# Altium project int_lock.PrjPcb
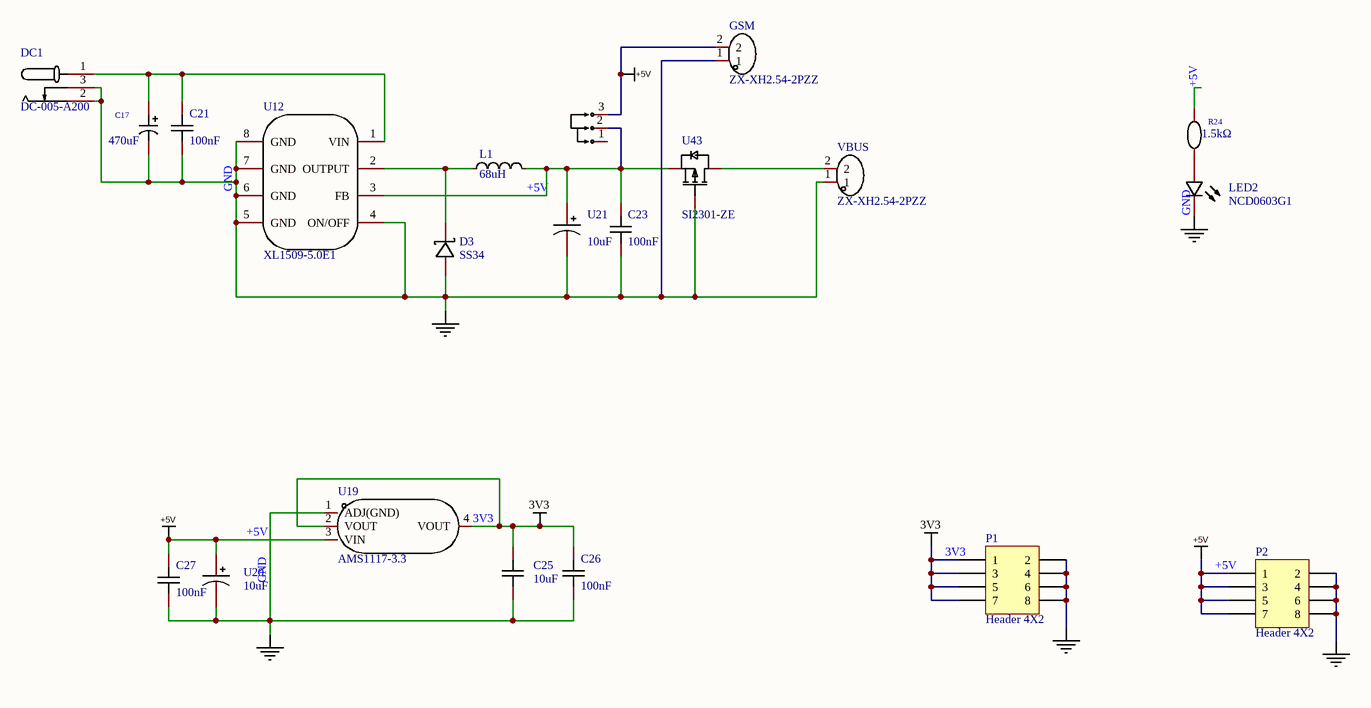
[diagram p0: 4_POW.schdoc.schdoc]
3 sheets, 60 parts. Net scope: global (net labels, ports and power ports of the same name join across sheets).
Board file: PCB1.pcbdoc
Sheets:
  4_POW.schdoc.schdoc
  3_语音模块.schdoc.schdoc
  2_MCU.schdoc.schdoc

## Sheet 4_POW.schdoc.schdoc
size 309 x 223 mm; Symbol: Sheet-Symbol_A4; Device: Sheet-Symbol_A4; @Page Name: POW.Schematic1; @Create Date: 2023-10-28; @Page Count: 4; @Page No: 3; @Project Name: New Project_2023-10-25_23-03-02; @Schematic Name: Schematic1; @Update Date: 2023-11-27; Company: 嘉立创EDA; Page Size: A4; Version: V1.0; SheetNumber: 1; SheetTotal: 4

### Parts
(Parts that share a designator on the sheet are numbered #1, #2 ... from top to bottom, then left to right.)
C17  470uF  [CAP-SMD_BD6.3-L6.6-W6.6-LS7.6-RD]
C21  100nF  [C0603]
C23  100nF  [C0603]
C25  10uF  [C0603]
C26  100nF  [C0603]
C27  100nF  [C0603]
D3  SS34  [SMA_L4.3-W2.6-LS5.0-RD]
DC1  DC-005-A200  [DC-IN-TH_DC-005-A200]
GSM  ZX-XH2.54-2PZZ  [CONN-TH_2P-P2.50_HX25003-2A]
L1  68uH  [IND-SMD_L6.0-W6.0_SWPA6045S]
LED2  NCD0603G1  [LED0603-RD]
P1  Header 4X2  [HDR2X4]
P2  Header 4X2  [HDR2X4]
R24  1.5kΩ  [R0603]
SW??  SS12D10G4 071  [3PINSW]  (value not drawn)
U12#1  XL1509-5.0E1  [SOIC-8_L5.0-W4.0-P1.27-LS6.0-BL]
U19  AMS1117-3.3  [SOT-223-3_L6.5-W3.4-P2.30-LS7.0-BR]
U20  10uF  [CAP-TH_BD6.3-P2.50-D0.5-FD]
U21  10uF  [CAP-TH_BD6.3-P2.50-D0.5-FD]
U43  SI2301-ZE  [SOT-23-3_L2.9-W1.3-P1.90-LS2.4-BR]
VBUS  ZX-XH2.54-2PZZ  [CONN-TH_2P-P2.50_HX25003-2A]

### Nets
3V3: C25.2 C26.2 P1.1 P1.3 P1.5 P1.7 U19.2(VOUT) U19.4(VOUT)
+5V: C23.2 C27.2 GSM.2 L1.2 P2.1 P2.3 P2.5 P2.7 R24.2 SW??.2 SW??.3 U12#1.3(FB) U19.3(VIN) U20.1 U21.1 U43.2(S)
GND: C17.2 C21.1 C23.1 C25.1 C26.1 C27.1 D3.2(A) DC1.2 DC1.3 GSM.1 LED2.1(K) P1.2 P1.4 P1.6 P1.8 P2.2 P2.4 P2.6 P2.8 U12#1.4(ON/OFF) U12#1.5(GND) U12#1.6(GND) U12#1.7(GND) U12#1.8(GND) U19.1(ADJ(GND)) U20.2 U21.2 U43.1(G) VBUS.1
NetC17_1: C17.1 C21.2 DC1.1 U12#1.1(VIN)
NetD3_1: D3.1(K) L1.1 U12#1.2(OUTPUT)
NetLED2_2: LED2.2(A) R24.1
NetU43_3: U43.3(D) VBUS.2

Not connected (* = marked no-connect by the designer): SW?? 1

### Notes on the sheet
- 1
- 2
- 3
- 4
- 5
- 6
- A
- B
- C
- 原理图
- Schematic1
- 创建日期
- 更新日期
- 2023-10-28
- 2023-11-27
- 审阅
- 绘制
- 图页
- POW.Schematic1
- 物料编码
- New Project_2023-10-25_23-03-02
- D
- 版本
- 尺寸
- 页
- 共
- V1.0
- A4
- 嘉立创EDA

### Library data of the parts
C17 = RVT1C471M0607: 容值:470uF;精度:±20%;额定电压:16V;电容体直径:6.3mm;电容体长度:7.7mm;工作寿命:2000hrs@105℃;工作温度:-55℃~+105℃;; Manufacturer: ROQANG(容强); Add into BOM: yes; Tolerance: ±20%; Rated Voltage: 16V; φD: 6.3mm; L: 7.7mm; Name: 470uF; Symbol: RVT1C471M0607; Device: RVT1C471M0607; LCSC Part Name: 470uF ±20% 16V; Supplier Part: C2977552; Manufacturer Part: RVT1C471M0607; Supplier Footprint: SMD,6.3x7.7mm; JLCPCB Part Class: 扩展库; Supplier: LCSC; Convert to PCB: yes; Value: 470uF; Lifetime @ Temp: 2000hrs@105℃; Operating Temperature: -55℃~+105℃
C21 C23 C26 C27 = CGA3E3X8R1H104M080AE: 容值:100nF;精度:±20%;额定电压:50V;材质(温度系数):X8R;; Manufacturer: TDK; Add into BOM: yes; Tolerance: ±20%; Voltage Rated: 50V; Temperature Coefficient: X8R; Name: 100nF; Symbol: CGA3E3X8R1H104M080AE; Device: CGA3E3X8R1H104M080AE; LCSC Part Name: 100nF ±20% 50V; Supplier Part: C3855738; Manufacturer Part: CGA3E3X8R1H104M080AE; Supplier Footprint: 0603; Supplier: LCSC; Convert to PCB: yes; Value: 100nF
C25 = C1608X6S0J106M080AC: 容值:10uF;精度:±20%;额定电压:6.3V;材质(温度系数):X6S;; Manufacturer: TDK; Symbol: C1608X6S0J106M080AC_C314596-1; Add into BOM: yes; Tolerance: ±20%; Voltage Rated: 6.3V; Temperature Coefficient: X6S; Name: 10uF; Device: C1608X6S0J106M080AC; LCSC Part Name: 10uF ±20% 6.3V; Supplier Part: C314596; Manufacturer Part: C1608X6S0J106M080AC; Supplier Footprint: 0603; Datasheet: https://atta.szlcsc.com/upload/public/pdf/source/20221212/519F8C46C56E78A46759B3245CB4AD37.pdf; Supplier: LCSC; Convert to PCB: yes; Value: 10uF
D3 = SS34: Symbol: SS34_C9900023345; Add into BOM: yes; Name: SS34; Device: SS34; LCSC Part Name: SS34; Supplier Part: C9900023345; Manufacturer Part: SS34; Supplier Footprint: SMA,DO-214AC; JLCPCB Part Class: 扩展库; Datasheet: 2022-07-04/534833A/5ff3008f79ea4c6ab22b1f3463cee262/20210714020425519.pdf; Supplier: LCSC; Convert to PCB: yes
DC1 = DC-005-A200: DC-005 外径6.4 内芯2.0 3A电流 DC电源插座; Manufacturer: XUNPU(讯普); Add into BOM: yes; Name: DC-005-A200; Symbol: DC-005-A200; Device: DC-005-A200; LCSC Part Name: DC-005-A200; Supplier Part: C720557; Manufacturer Part: DC-005-A200; Supplier Footprint: 14×9.0×11.0mm; JLCPCB Part Class: 扩展库; Datasheet: https://atta.szlcsc.com/upload/public/pdf/source/20200812/C720557_2286DFCD6C75B71AF905731F627ABF3A.pdf; Supplier: LCSC; Convert to PCB: yes
GSM VBUS = ZX-XH2.54-2PZZ: 参考系列:XH;间距:2.54mm;插针结构:1x2P;排数:1;每排PIN数:2;行距:-;公母:公型插针;安装方式:直插;额定电流:3A;触头材质:黄铜;触头镀层:锡;工作温度范围:-25℃~+85℃;焊接温度(最大值):260℃;; Manufacturer: Megastar(兆星); Add into BOM: yes; Reference Series: XH; Pitch: 2.54mm; Pins Structure: 1x2P; Number of PINs Per Row: 2; Gender: 公型插针; Current Rating (Max): 3A; Welding Temperature (Max): 260℃; Name: ZX-XH2.54-2PZZ; Symbol: ZX-XH2.54-2PZZ; Device: ZX-XH2.54-2PZZ; LCSC Part Name: 系列:XH 间距:2.54mm 1x2P 直插; Supplier Part: C7429632; Manufacturer Part: ZX-XH2.54-2PZZ; Supplier Footprint: 插件,P=2.54mm; JLCPCB Part Class: 扩展库; Datasheet: https://atta.szlcsc.com/upload/public/pdf/source/20230619/19BA6947230AA44A04D3EDD65E618FD0.pdf; Supplier: LCSC; Convert to PCB: yes; Number of Rows: 1; Row Spacing: -; Mounting Style: 直插; Contact Material: 黄铜; Contact Plating: 锡; Operating Temperature Range: -25℃~+85℃
L1 = SWPA6045S680MT: 类型:-;电感值:68uH;精度:±20%;额定电流:1A;饱和电流(Isat):1.2A;; Manufacturer: Sunlord(顺络); Add into BOM: yes; Tolerance: ±20%; Rated Current: 1A; Saturation Current (Isat): 1.2A; DC Resistance (DCR): 289mΩ; Name: 68uH; Symbol: SWPA6045S680MT; Device: SWPA6045S680MT; LCSC Part Name: 68uH ±20% 1.2A; Supplier Part: C53663; Manufacturer Part: SWPA6045S680MT; Supplier Footprint: SMD; JLCPCB Part Class: 扩展库; Datasheet: https://atta.szlcsc.com/upload/public/pdf/source/20210916/AC798BA7E846B7D0B6818F45CD84DB0B.pdf; Supplier: LCSC; Convert to PCB: yes; Type: -; Value: 68uH; Ratings: -
LED2 = NCD0603G1: 发光颜色:翠绿色;功率:72mW;透镜颜色:无色透明;主波长:515nm~530nm;发光强度:330mcd~900mcd;发光角度:130°;工作温度:-30℃~+85℃;; Manufacturer: 国星光电; Symbol: FC-D1608UGK-520D10; Add into BOM: yes; Emitted Color: 翠绿色; Forward Voltage (VF): 2.6V~3.6V; Forward Current: 10mA; Power Dissipation: 72mW; Lens Color: 无色透明; Viewing Angle: 130°; Name: NCD0603G1; Device: NCD0603G1; LCSC Part Name: 翠绿 0603翠绿  正贴; Supplier Part: C84267; Manufacturer Part: NCD0603G1; Supplier Footprint: 0603; JLCPCB Part Class: 扩展库; Datasheet: https://atta.szlcsc.com/upload/public/pdf/source/20200820/C84267_04BA7703640BAC111D09F5EFB971FBF3.pdf; Supplier: LCSC; Convert to PCB: yes; Dominant Wavelength: 515nm~530nm; Luminous Intensity: 330mcd~900mcd; Operating Temperature: -30℃~+85℃
P1 P2 = Header 4X2: Header, 4-Pin, Dual row; LatestRevisionDate: 17-Jul-2002; LatestRevisionNote: Re-released for DXP Platform.; Publisher: Altium Limited
R24 = SCR0603F1K: 阻值:1.5kΩ;精度:±1%;; Manufacturer: VO(翔胜); Name: Value; Add into BOM: yes; Value: 1kΩ; Tolerance: ±1%; Symbol: SCR0603F1K; Device: SCR0603F1K; LCSC Part Name: 1kΩ ±1%; Supplier Part: C3016283; Manufacturer Part: SCR0603F1K; Supplier Footprint: 0603; JLCPCB Part Class: 扩展库; Datasheet: https://atta.szlcsc.com/upload/public/pdf/source/20220513/247AF9639BA21CF93567DC289CCC6A22.pdf; Supplier: LCSC; Convert to PCB: yes
SW?? = SS12D10G4 071: Manufacturer: SHOU HAN(首韩); Add into BOM: yes; Circuit: 单刀双掷; Pin Style: PC引脚; Switch Length: 12.7mm; Switch Width: 6.7mm; Switch Height: 6.4mm; Current Rating (DC): 2A; Voltage Rating (DC): 125V; Mechanical Life: 3千次; Symbol: SS12D10G4 071; Device: SS12D10G4 071; Supplier: LCSC; Supplier Part: C2887259; Manufacturer Part: SS12D10G4 071; JLCPCB Part Class: Extended Part; LCSC Part Name: SS12D10G4 071; Supplier Footprint: 插件; Datasheet: https://atta.szlcsc.com/upload/public/pdf/source/20210820/80D1704BBF3FCEE0435FCAA54C61E0A3.pdf; Convert to PCB: yes; Actuator Style: -; Mounting Style: 立插; Actuator Color: -; Current Rating (AC): -; Voltage Rating (AC): -; Operating Temperature: -16℃~+60℃
U12#1 = XL1509-5.0E1: 功能类型:降压型;输入电压:-;输出电流(最大值):-;; Manufacturer: XLSEMI(芯龙); Add into BOM: yes; Function: 降压型; Name: XL1509-5.0E1; Symbol: XL1509-5.0E1; Device: XL1509-5.0E1; LCSC Part Name: XL1509-5.0E1; Supplier Part: C61063; Manufacturer Part: XL1509-5.0E1; Supplier Footprint: SOP-8; JLCPCB Part Class: 基础库; Datasheet: https://atta.szlcsc.com/upload/public/pdf/source/20151126/1457707596805.pdf; Supplier: LCSC; Convert to PCB: yes; Synchronous Rectification: -; Number of Outputs: -; Topology: -; Input Voltage: -; Output Current (Max): -; Switching Frequency: -
U19 = AMS1117-3.3: 输出类型:固定;输出极性:正;输出通道数:1;最大输入电压:18V;输出电压:3.3V;压差:1.3V@(1A);输出电流:1A;电源纹波抑制比(PSRR):60dB@(120Hz);工作温度:±150℃@(Tj);; Manufacturer: YONGYUTAI(永裕泰); Symbol: AMS1117-3.3_C2891839; Add into BOM: yes; Output Type: 固定; Output Polarity: 正; Number of Outputs: 1; Maximum Input Voltage: 18V; Output Voltage: 3.3V; Name: AMS1117-3.3; Device: AMS1117-3.3; LCSC Part Name: 正 Vin=18V Vout=3.3V 1A 60dB@(120Hz); Supplier Part: C2891839; Manufacturer Part: AMS1117-3.3; Supplier Footprint: SOT-223-3; JLCPCB Part Class: 扩展库; Datasheet: https://atta.szlcsc.com/upload/public/pdf/source/20210901/A75ADDE6A17DEE0002F2A58A8D1F3634.pdf; Supplier: LCSC; Convert to PCB: yes; Dropout Voltage: 1.3V@(1A); Output Current: 1A; Power Supply Rejection Ratio (PSRR): 60dB@(120Hz); Operating Temperature: ±150℃@(Tj)
U20 U21 = ESK106M1HD11RRSNP-R: 容值:10uF;精度:±20%;额定电压:50V;纹波电流:-;等效串联电阻:-;; Manufacturer: MAN YUE(万裕科技); Add into BOM: yes; Tolerance: ±20%; Rated Voltage: 50V; φD: 5mm; L: 11mm; Name: 10uF; Symbol: ESK106M1HD11RRSNP-R; Device: ESK106M1HD11RRSNP-R; LCSC Part Name: 10uF ±20% 50V; Supplier Part: C3015490; Manufacturer Part: ESK106M1HD11RRSNP-R; Supplier Footprint: 插件; JLCPCB Part Class: 扩展库; Datasheet: https://atta.szlcsc.com/upload/public/pdf/source/20190724/C406799_CDF11B2185D3B9C175922EABD678815E.pdf; Supplier: LCSC; Convert to PCB: yes; Value: 10uF; Lead Spacing: -; Ripple Current: -; Equivalent Series Resistance(ESR): -; Lifetime @ Temp: -; Operating Temperature: -
U43 = SI2301-ZE: 漏源电压(Vdss):20V;连续漏极电流(Id):2.3A;功率(Pd):700mW;类型:P沟道;导通电阻(RDS(on)@Vgs,Id):126mΩ@4.5V;; Manufacturer: HXY MOSFET(华轩阳电子); Add into BOM: yes; Gate Threshold Voltage (Vgs(th)@Id): 1V@250uA; Drain Source Voltage (Vdss): 20V; Continuous Drain Current (Id): 2.3A; Power Dissipation (Pd): 700mW; Input Capacitance (Ciss@Vds): 285pF; Name: SI2301-ZE; Symbol: SI2301-ZE; Device: SI2301-ZE; LCSC Part Name: P沟道 耐压:20V 电流:2.3A; Supplier Part: C5261052; Manufacturer Part: SI2301-ZE; Supplier Footprint: SOT-23; JLCPCB Part Class: 扩展库; Datasheet: https://atta.szlcsc.com/upload/public/pdf/source/20230515/2FF2907841563ED329594D3237822724.pdf; Supplier: LCSC; Convert to PCB: yes; Type: P沟道; Drain Source On Resistance (RDS(on)@Vgs,Id): 126mΩ@4.5V

## Sheet 3_语音模块.schdoc.schdoc
size 309 x 223 mm; Symbol: Sheet-Symbol_A4; Device: Sheet-Symbol_A4; @Page Name: 语音模块; @Create Date: 2023-10-28; @Page Count: 4; @Page No: 2; @Project Name: New Project_2023-10-25_23-03-02; @Schematic Name: Schematic1; @Update Date: 2023-11-07; Company: 嘉立创EDA; Page Size: A4; Version: V1.0; SheetNumber: 2; SheetTotal: 4
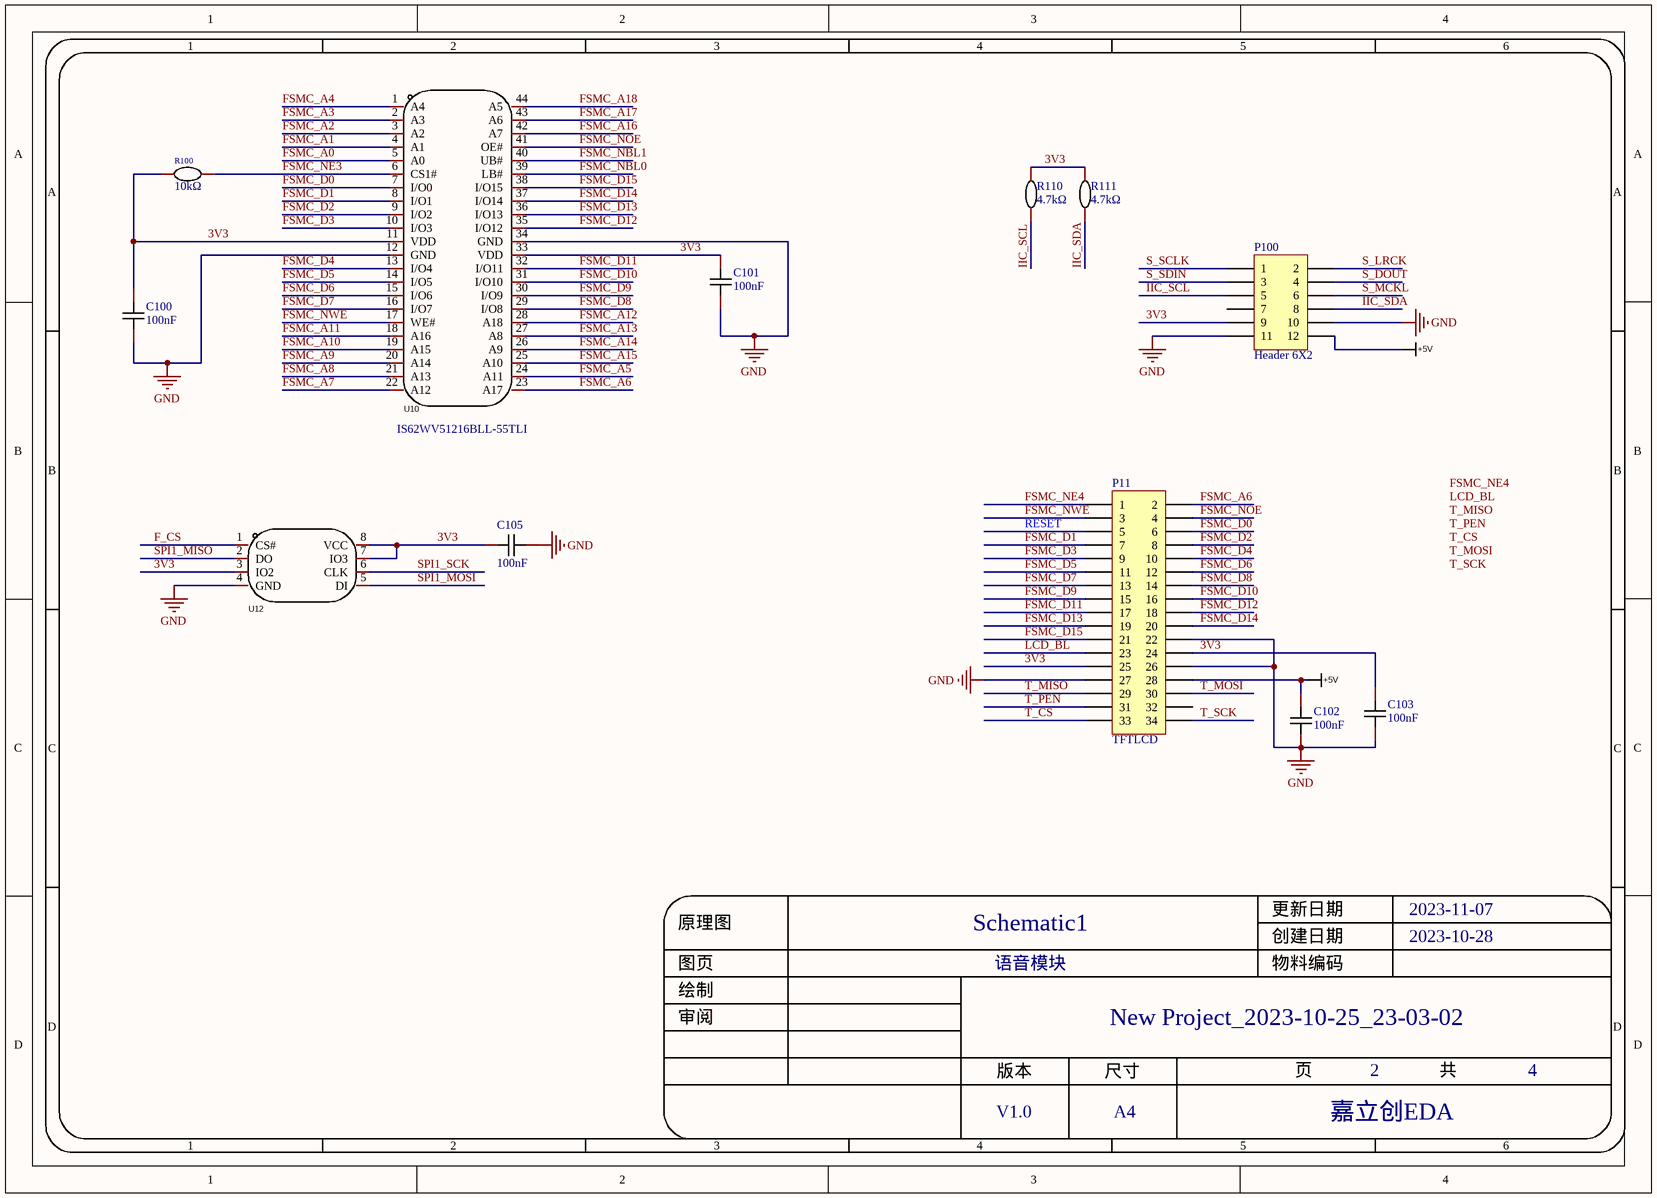
[diagram p1: 3_语音模块.schdoc.schdoc]

### Parts
(Parts that share a designator on the sheet are numbered #1, #2 ... from top to bottom, then left to right.)
C100  100nF  [C0603]
C101  100nF  [C0603]
C102  100nF  [C0603]
C103  100nF  [C0603]
C105  100nF  [C0603]
P11  TFTLCD  [HDR2X17]
P100  Header 6X2  [HDR2X6]
R100  10kΩ  [R0603]
R110  4.7kΩ  [R0603]
R111  4.7kΩ  [R0603]
U10  IS62WV51216BLL-55TLI  [SRAM]
U12#2  W25Q128JVSIQ  [eeprom]  (value not drawn)

### Nets
3V3: C100.2 C101.2 C103.2 C105.2 P11.24 P11.25 P100.9 R100.1 R110.2 R111.2 U10.11(VDD) U10.33(VDD) U12#2.3(IO2) U12#2.7(IO3) U12#2.8(VCC)
+5V: C102.2 P11.28 P100.12
GND: C100.1 C101.1 C102.1 C103.1 C105.1 P11.22 P11.26 P11.27 P100.10 P100.11 U10.12(GND) U10.34(GND) U12#2.4(GND)
F_CS: U12#2.1(CS#)
FSMC_A0: U10.5(A0)
FSMC_A1: U10.4(A1)
FSMC_A2: U10.3(A2)
FSMC_A3: U10.2(A3)
FSMC_A4: U10.1(A4)
FSMC_A5: U10.24(A11)
FSMC_A6: P11.2 U10.23(A17)
FSMC_A7: U10.22(A12)
FSMC_A8: U10.21(A13)
FSMC_A9: U10.20(A14)
FSMC_A10: U10.19(A15)
FSMC_A11: U10.18(A16)
FSMC_A12: U10.28(A18)
FSMC_A13: U10.27(A8)
FSMC_A14: U10.26(A9)
FSMC_A15: U10.25(A10)
FSMC_A16: U10.42(A7)
FSMC_A17: U10.43(A6)
FSMC_A18: U10.44(A5)
FSMC_D0: P11.6 U10.7(I/O0)
FSMC_D1: P11.7 U10.8(I/O1)
FSMC_D2: P11.8 U10.9(I/O2)
FSMC_D3: P11.9 U10.10(I/O3)
FSMC_D4: P11.10 U10.13(I/O4)
FSMC_D5: P11.11 U10.14(I/O5)
FSMC_D6: P11.12 U10.15(I/O6)
FSMC_D7: P11.13 U10.16(I/O7)
FSMC_D8: P11.14 U10.29(I/O8)
FSMC_D9: P11.15 U10.30(I/O9)
FSMC_D10: P11.16 U10.31(I/O10)
FSMC_D11: P11.17 U10.32(I/O11)
FSMC_D12: P11.18 U10.35(I/O12)
FSMC_D13: P11.19 U10.36(I/O13)
FSMC_D14: P11.20 U10.37(I/O14)
FSMC_D15: P11.21 U10.38(I/O15)
FSMC_NBL0: U10.39(LB#)
FSMC_NBL1: U10.40(UB#)
FSMC_NE3: R100.2 U10.6(CS1#)
FSMC_NE4: P11.1
FSMC_NOE: P11.4 U10.41(OE#)
FSMC_NWE: P11.3 U10.17(WE#)
IIC_SCL: P100.5 R110.1
IIC_SDA: P100.8 R111.1
LCD_BL: P11.23
RESET: P11.5
S_DOUT: P100.4
S_LRCK: P100.2
S_MCKL: P100.6  [project net DCMI_D0]
S_SCLK: P100.1
S_SDIN: P100.3
SPI1_MISO: U12#2.2(DO)
SPI1_MOSI: U12#2.5(DI)
SPI1_SCK: U12#2.6(CLK)
T_CS: P11.33
T_MISO: P11.29
T_MOSI: P11.30
T_PEN: P11.31
T_SCK: P11.34

Not connected (* = marked no-connect by the designer): P11 32; P100 7

### Notes on the sheet
- Labels drawn without touching a wire or pin: FSMC_NE4, LCD_BL, T_CS, T_MISO, T_MOSI, T_PEN, T_SCK
- 1
- 2
- 3
- 4
- 5
- 6
- A
- B
- C
- 原理图
- Schematic1
- 创建日期
- 更新日期
- 2023-10-28
- 2023-11-07
- 审阅
- 绘制
- 图页
- 语音模块
- 物料编码
- New Project_2023-10-25_23-03-02
- D
- 版本
- 尺寸
- 页
- 共
- V1.0
- A4
- 嘉立创EDA

### Library data of the parts
C100-C103 C105 = CGA3E3X8R1H104M080AE: as C21 on sheet 4_POW.schdoc; Symbol: CGA3E3X8R1H104M080AE; Device: CGA3E3X8R1H104M080AE; LCSC Part Name: 100nF ±20% 50V; Supplier Part: C3855738; Manufacturer Part: CGA3E3X8R1H104M080AE; Supplier Footprint: 0603; Supplier: LCSC; Convert to PCB: yes; Value: 100nF; Name: 100nF
P11 = Header 17X2: Header, 17-Pin, Dual row; LatestRevisionDate: 17-Jul-2002; LatestRevisionNote: Re-released for DXP Platform.; Publisher: Altium Limited
P100 = Header 6X2: Header, 6-Pin, Dual row; LatestRevisionDate: 17-Jul-2002; LatestRevisionNote: Re-released for DXP Platform.; Publisher: Altium Limited
R100 = SCR0603J10K: 阻值:10kΩ;精度:±5%;; Manufacturer: VO(翔胜); Add into BOM: yes; Tolerance: ±5%; Name: 10kΩ; Symbol: SCR0603J10K; Device: SCR0603J10K; LCSC Part Name: 10kΩ ±5%; Supplier Part: C3017715; Manufacturer Part: SCR0603J10K; Supplier Footprint: 0603; JLCPCB Part Class: 扩展库; Datasheet: https://atta.szlcsc.com/upload/public/pdf/source/20220513/247AF9639BA21CF93567DC289CCC6A22.pdf; Supplier: LCSC; Convert to PCB: yes; Value: 10kΩ
R110 R111 = AR03FTDX4701A: 电阻类型:薄膜电阻;阻值:4.7kΩ;精度:±1%;功率:100mW;; Manufacturer: Viking(光颉); Add into BOM: yes; Tolerance: ±1%; Power(Watts): 100mW; Temperature Coefficient: ±50ppm/℃; Overload Voltage (Max): 75V; Name: 4.7kΩ; Symbol: AR03FTDX4701A; Device: AR03FTDX4701A; LCSC Part Name: 4.7kΩ ±1% 100mW; Supplier Part: C2924150; Manufacturer Part: AR03FTDX4701A; Supplier Footprint: 0603; JLCPCB Part Class: 扩展库; Datasheet: https://atta.szlcsc.com/upload/public/pdf/source/20211123/7AFDB03DAF68AA91648A852AAE26A3AB.pdf; Supplier: LCSC; Convert to PCB: yes; Type: 薄膜电阻; Value: 4.7kΩ; Operating Temperature Range: -55℃~+155℃
U10 = IS62WV51216BLL-55TLI: Manufacturer: ISSI(美国芯成); Add into BOM: yes; Symbol: IS62WV51216BLL-55TLI; Device: IS62WV51216BLL-55TLI; Supplier: LCSC; Manufacturer Part: IS62WV51216BLL-55TLI; Supplier Part: C11315; JLCPCB Part Class: Extended Part; LCSC Part Name: IS62WV51216BLL-55TLI; Supplier Footprint: TSOPII-44; Datasheet: https://atta.szlcsc.com/upload/public/pdf/source/20130225/1457706593006.pdf; Convert to PCB: yes
U12#2 = W25Q128JVSIQ: Manufacturer: WINBOND(华邦); Symbol: W25Q128JVSIQTR; Add into BOM: yes; Memory Size: 128Mbit; Device: W25Q128JVSIQ; Supplier: LCSC; Manufacturer Part: W25Q128JVSIQ; Supplier Part: C97521; JLCPCB Part Class: Basic Part; LCSC Part Name: W25Q128JVSIQ 编带; Supplier Footprint: SOP-8-208mil; Datasheet: https://atta.szlcsc.com/upload/public/pdf/source/20170316/1489627409956.pdf; Convert to PCB: yes; Interface Type: -; Clock Frequency (fc): -; Supply Voltage: -; Supply Current (Read): -; Supply Current (Program): -; Supply Current (Erase): -; Standby supply current: -; Page Programming Time (Tpp): -; Block Erase Time (tBE): -; Data Retention - TDR (Year): -; Operating Temperature: -

## Sheet 2_MCU.schdoc.schdoc
size 431 x 309 mm; Symbol: Sheet-Symbol_A4; Device: Sheet-Symbol_A4; @Page Name: MCU; @Create Date: 2023-11-05; @Page Count: 4; @Page No: 4; @Project Name: New Project_2023-10-25_23-03-02; @Schematic Name: Schematic1; @Update Date: 2023-12-01; Company: 嘉立创EDA; Page Size: A4; Version: V1.0; SheetNumber: 4; SheetTotal: 4
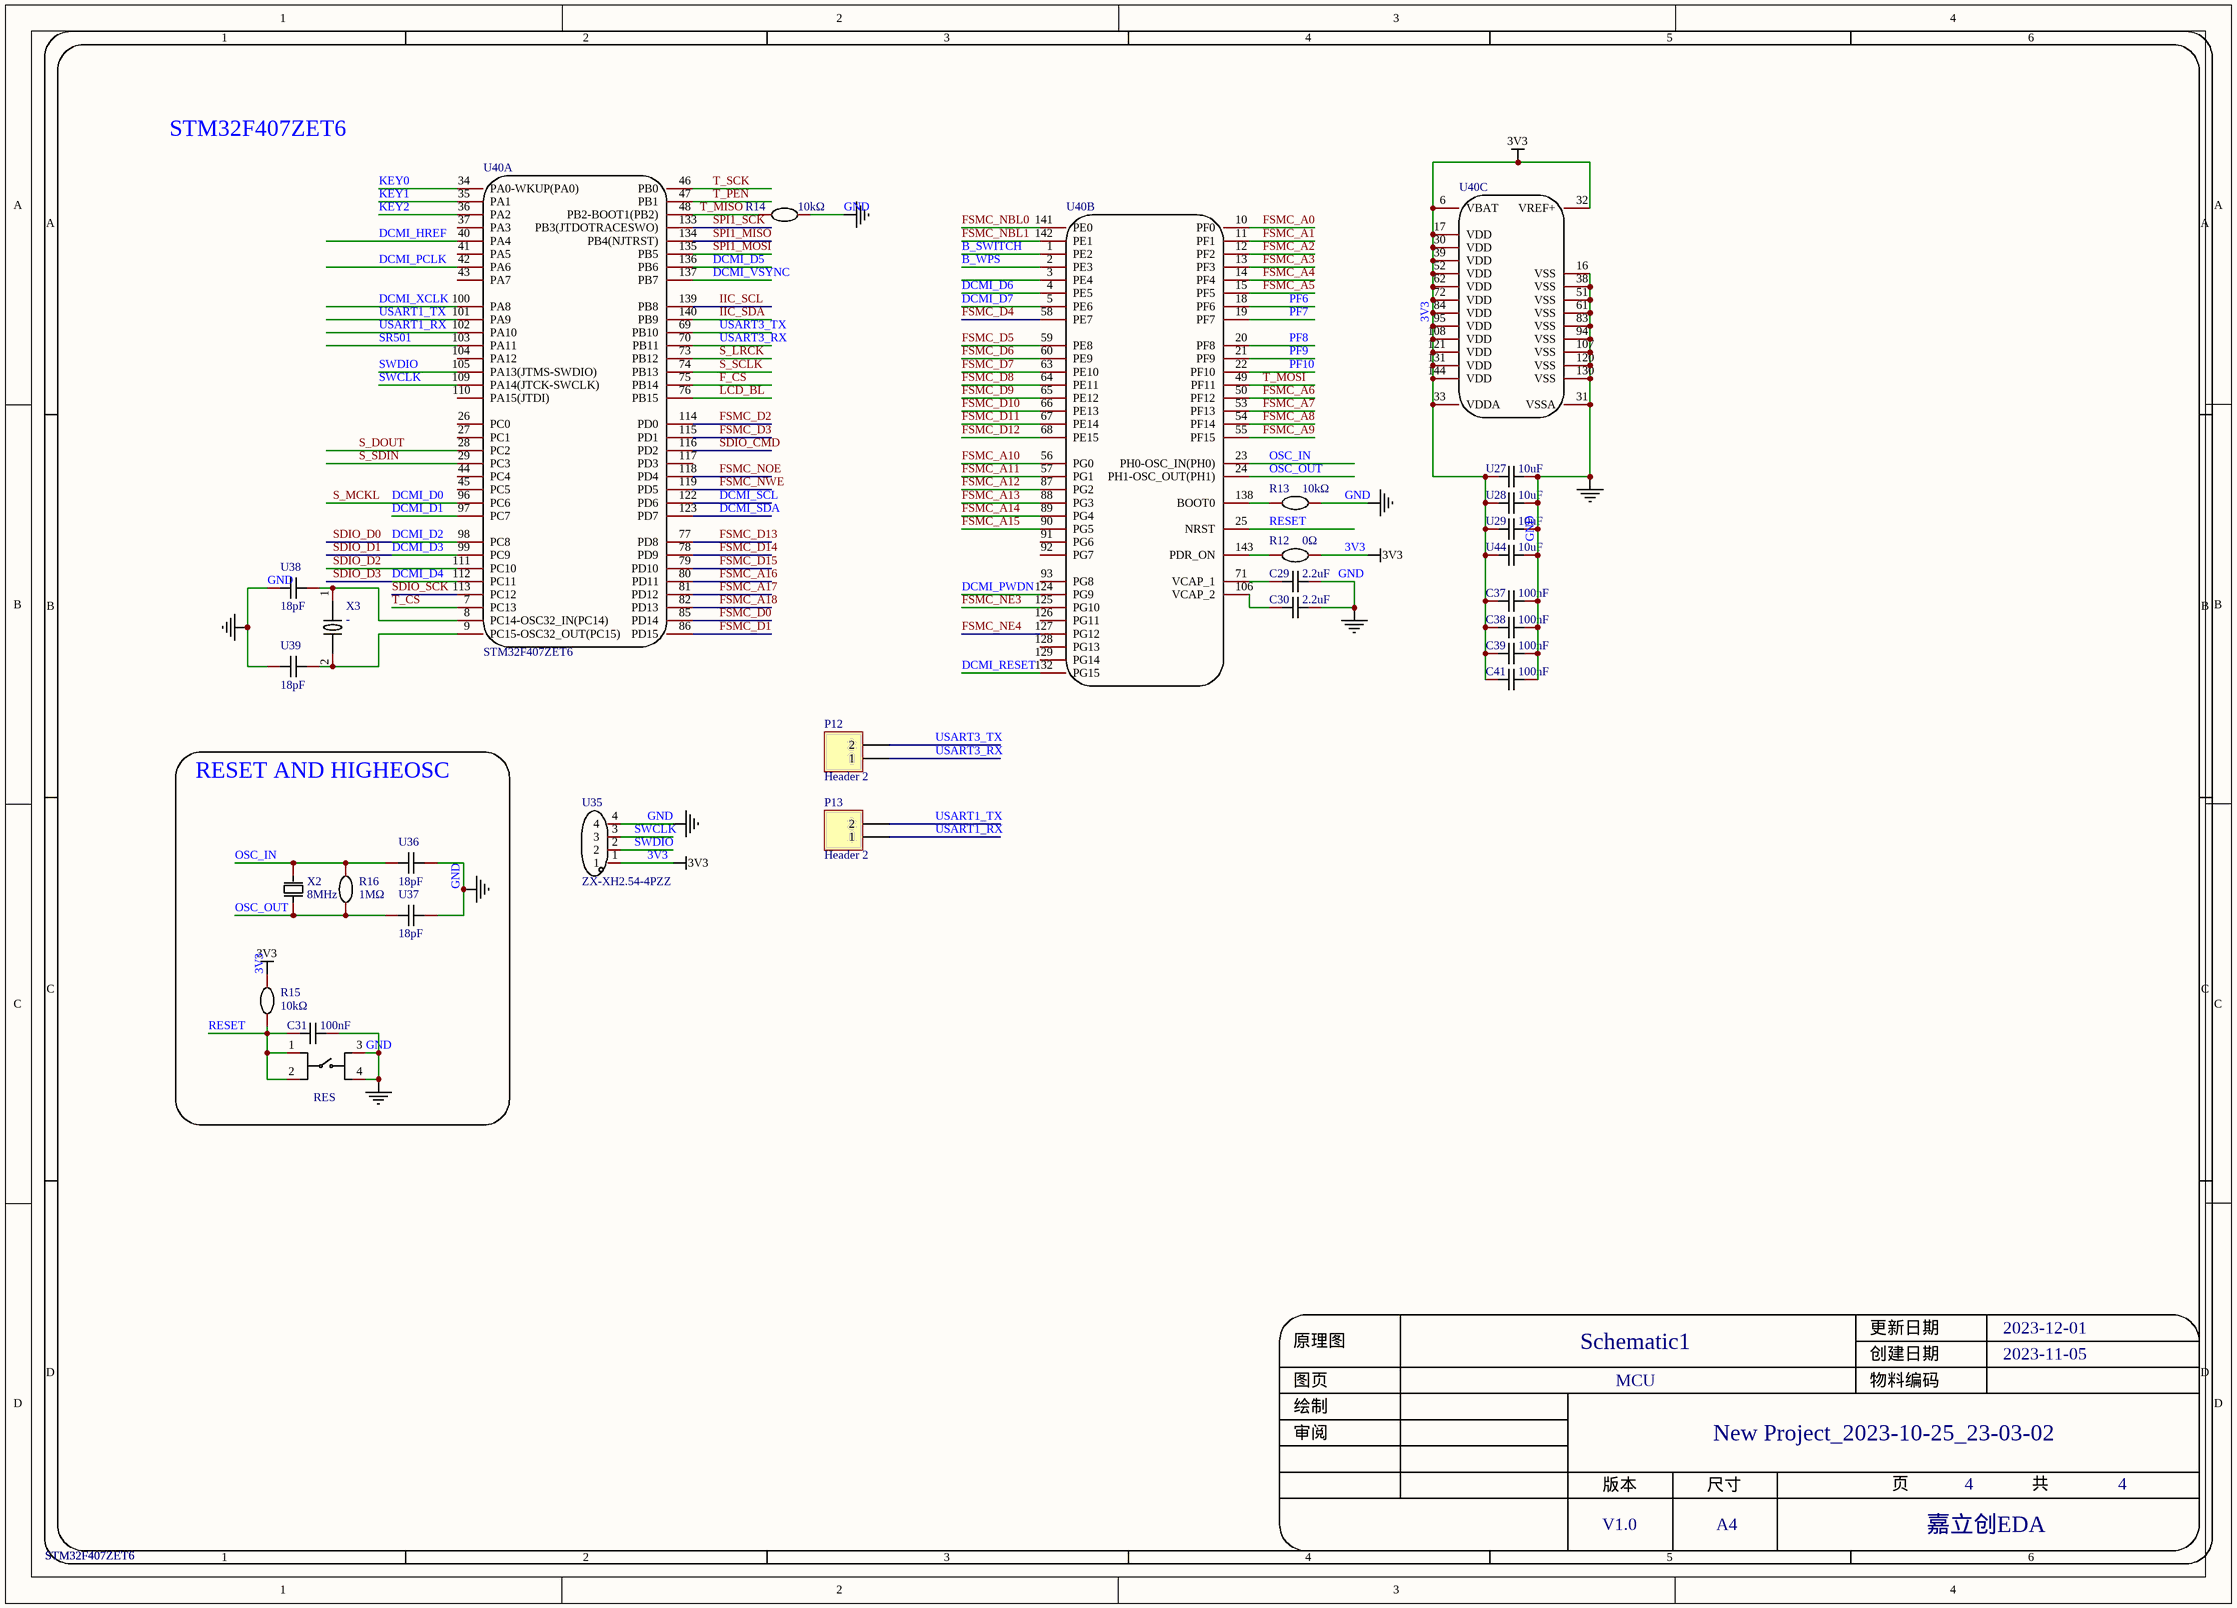
[diagram p2: 2_MCU.schdoc.schdoc]

### Parts
C29  2.2uF  [C0603]
C30  2.2uF  [C0603]
C31  100nF  [C0603]
C37  100nF  [C0603]
C38  100nF  [C0603]
C39  100nF  [C0603]
C41  100nF  [C0603]
P12  Header 2  [HDR1X2]
P13  Header 2  [HDR1X2]
R12  0Ω  [R0603]
R13  10kΩ  [R0603]
R14  10kΩ  [R0603]
R15  10kΩ  [R0603]
R16  1MΩ  [R0603]
RES  K2-6639SP-C4SC-04  [KEY-SMD_4P-L6.0-W6.0-P3.90-LS10.0]  (value not drawn)
U27  10uF  [C0603]
U28  10uF  [C0603]
U29  10uF  [C0603]
U35  ZX-XH2.54-4PZZ  [CONN-TH_4P-P2.50_4PIN]
U36  18pF  [C0603]
U37  18pF  [C0603]
U38  18pF  [C0603]
U39  18pF  [C0603]
U40  STM32F407ZET6  [LQFP-144_L20.0-W20.0-P0.50-LS22.0-BL]  (parts A,B,C of 3)
U44  10uF  [C0603]
X2  8MHz  [OSC-SMD_L5.0-W3.2]
X3  -  [OSC-SMD_2P-L1.6-W1.0]

### Blocks framed on the sheet
RESET AND HIGHEOSC: C31 R15 R16 RES U36 U37 X2

### Nets
3V3: C37.1 C38.1 C39.1 C41.1 R12.2 R15.2 U27.1 U28.1 U29.1 U35.1 U40.6(VBAT) U40.17(VDD) U40.30(VDD) U40.32(VREF+) U40.33(VDDA) U40.39(VDD) U40.52(VDD) U40.62(VDD) U40.72(VDD) U40.84(VDD) U40.95(VDD) U40.108(VDD) U40.121(VDD) U40.131(VDD) U40.144(VDD) U44.1
GND: C29.2 C30.2 C31.2 C37.2 C38.2 C39.2 C41.2 R13.2 R14.2 RES.3 RES.4 U27.2 U28.2 U29.2 U35.4 U36.2 U37.2 U38.1 U39.1 U40.16(VSS) U40.31(VSSA) U40.38(VSS) U40.51(VSS) U40.61(VSS) U40.83(VSS) U40.94(VSS) U40.107(VSS) U40.120(VSS) U40.130(VSS) U44.2
B_SWITCH: U40.1(PE2)
B_WPS: U40.2(PE3)
DCMI_D0: U40.96(PC6)  [also labelled S_MCKL]
DCMI_D1: U40.97(PC7)
DCMI_D2: U40.98(PC8)  [also labelled SDIO_D0]
DCMI_D3: U40.99(PC9)  [also labelled SDIO_D1]
DCMI_D4: U40.112(PC11)  [also labelled SDIO_D3]
DCMI_D5: U40.136(PB6)
DCMI_D6: U40.4(PE5)
DCMI_D7: U40.5(PE6)
DCMI_HREF: U40.40(PA4)
DCMI_PCLK: U40.42(PA6)
DCMI_PWDN: U40.124(PG9)
DCMI_RESET: U40.132(PG15)
DCMI_SCL: U40.122(PD6)
DCMI_SDA: U40.123(PD7)
DCMI_VSYNC: U40.137(PB7)
DCMI_XCLK: U40.100(PA8)
F_CS: U40.75(PB14)
FSMC_A0: U40.10(PF0)
FSMC_A1: U40.11(PF1)
FSMC_A2: U40.12(PF2)
FSMC_A3: U40.13(PF3)
FSMC_A4: U40.14(PF4)
FSMC_A5: U40.15(PF5)
FSMC_A6: U40.50(PF12)
FSMC_A7: U40.53(PF13)
FSMC_A8: U40.54(PF14)
FSMC_A9: U40.55(PF15)
FSMC_A10: U40.56(PG0)
FSMC_A11: U40.57(PG1)
FSMC_A12: U40.87(PG2)
FSMC_A13: U40.88(PG3)
FSMC_A14: U40.89(PG4)
FSMC_A15: U40.90(PG5)
FSMC_A16: U40.80(PD11)
FSMC_A17: U40.81(PD12)
FSMC_A18: U40.82(PD13)
FSMC_D0: U40.85(PD14)
FSMC_D1: U40.86(PD15)
FSMC_D2: U40.114(PD0)
FSMC_D3: U40.115(PD1)
FSMC_D4: U40.58(PE7)
FSMC_D5: U40.59(PE8)
FSMC_D6: U40.60(PE9)
FSMC_D7: U40.63(PE10)
FSMC_D8: U40.64(PE11)
FSMC_D9: U40.65(PE12)
FSMC_D10: U40.66(PE13)
FSMC_D11: U40.67(PE14)
FSMC_D12: U40.68(PE15)
FSMC_D13: U40.77(PD8)
FSMC_D14: U40.78(PD9)
FSMC_D15: U40.79(PD10)
FSMC_NBL0: U40.141(PE0)
FSMC_NBL1: U40.142(PE1)
FSMC_NE3: U40.125(PG10)
FSMC_NE4: U40.127(PG12)
FSMC_NOE: U40.118(PD4)
FSMC_NWE: U40.119(PD5)
IIC_SCL: U40.139(PB8)
IIC_SDA: U40.140(PB9)
KEY0: U40.34(PA0-WKUP(PA0))
KEY1: U40.35(PA1)
KEY2: U40.36(PA2)
LCD_BL: U40.76(PB15)
OSC_IN: R16.2 U36.1 U40.23(PH0-OSC_IN(PH0)) X2.2(OSC2)
OSC_OUT: R16.1 U37.1 U40.24(PH1-OSC_OUT(PH1)) X2.1(OSC1)
PF6: U40.18(PF6)
PF7: U40.19(PF7)
PF8: U40.20(PF8)
PF9: U40.21(PF9)
PF10: U40.22(PF10)
RESET: C31.1 R15.1 RES.1 RES.2 U40.25(NRST)
S_DOUT: U40.28(PC2)
S_LRCK: U40.73(PB12)
S_SCLK: U40.74(PB13)
S_SDIN: U40.29(PC3)
SDIO_CMD: U40.116(PD2)
SDIO_D2: U40.111(PC10)
SDIO_SCK: U40.113(PC12)
SPI1_MISO: U40.134(PB4(NJTRST))
SPI1_MOSI: U40.135(PB5)
SPI1_SCK: U40.133(PB3(JTDOTRACESWO))
SR501: U40.103(PA11)
SWCLK: U35.3 U40.109(PA14(JTCK-SWCLK))
SWDIO: U35.2 U40.105(PA13(JTMS-SWDIO))
T_CS: U40.7(PC13)
T_MISO: R14.1 U40.48(PB2-BOOT1(PB2))
T_MOSI: U40.49(PF11)
T_PEN: U40.47(PB1)
T_SCK: U40.46(PB0)
USART1_RX: P13.1 U40.102(PA10)
USART1_TX: P13.2 U40.101(PA9)
USART3_RX: P12.1 U40.70(PB11)
USART3_TX: P12.2 U40.69(PB10)
NetC29_1: C29.1 U40.71(VCAP_1)
NetC30_1: C30.1 U40.106(VCAP_2)
NetR12_1: R12.1 U40.143(PDR_ON)
NetR13_1: R13.1 U40.138(BOOT0)
NetU38_2: U38.2 U40.8(PC14-OSC32_IN(PC14)) X3.1
NetU39_2: U39.2 U40.9(PC15-OSC32_OUT(PC15)) X3.2

Not connected (* = marked no-connect by the designer): U40 3(PE4) 26(PC0) 27(PC1) 37(PA3) 41(PA5) 43(PA7) 44(PC4) 45(PC5) 91(PG6) 92(PG7) 93(PG8) 104(PA12) 110(PA15(JTDI)) 117(PD3) 126(PG11) 128(PG13) 129(PG14)

### Notes on the sheet
- STM32F407ZET6
- 1
- 2
- 3
- 4
- 5
- 6
- A
- B
- C
- D
- 原理图
- Schematic1
- 创建日期
- 更新日期
- 2023-11-05
- 2023-12-01
- 审阅
- 绘制
- 图页
- MCU
- 物料编码
- New Project_2023-10-25_23-03-02
- 版本
- 尺寸
- 页
- 共
- V1.0
- A4
- 嘉立创EDA

### Library data of the parts
C29 C30 = C1608X6S1A225K080AB: 容值:2.2uF;精度:±10%;额定电压:10V;材质(温度系数):X6S;; Manufacturer: TDK; Add into BOM: yes; Tolerance: ±10%; Voltage Rated: 10V; Temperature Coefficient: X6S; Name: 2.2uF; Symbol: C1608X6S1A225K080AB; Device: C1608X6S1A225K080AB; LCSC Part Name: 2.2uF ±10% 10V; Supplier Part: C3888161; Manufacturer Part: C1608X6S1A225K080AB; Supplier Footprint: 0603; Supplier: LCSC; Convert to PCB: yes; Value: 2.2uF
C31 C37-C39 C41 = CGA3E3X8R1H104M080AE: as C21 on sheet 4_POW.schdoc; Name: 100nF; Symbol: CGA3E3X8R1H104M080AE; Device: CGA3E3X8R1H104M080AE; LCSC Part Name: 100nF ±20% 50V; Supplier Part: C3855738; Manufacturer Part: CGA3E3X8R1H104M080AE; Supplier Footprint: 0603; Supplier: LCSC; Convert to PCB: yes; Value: 100nF
P12 P13 = Header 2: Header, 2-Pin; LatestRevisionDate: 17-Jul-2002; LatestRevisionNote: Re-released for DXP Platform.; Publisher: Altium Limited
R12 = RC0603JR-130RL: 电阻类型:厚膜电阻;阻值:0Ω;精度:-;功率:100mW;; Manufacturer: YAGEO(国巨); Add into BOM: yes; Power(Watts): 100mW; Overload Voltage (Max): 75V; Name: 0Ω; Symbol: RC0603JR-130RL; Device: RC0603JR-130RL; LCSC Part Name: 0Ω 100mW; Supplier Part: C1512169; Manufacturer Part: RC0603JR-130RL; Supplier Footprint: 0603; JLCPCB Part Class: 扩展库; Datasheet: https://atta.szlcsc.com/upload/public/pdf/source/20210615/C1512169_F749B83676031E9170C7C93785487C19.pdf; Supplier: LCSC; Convert to PCB: yes; Type: 厚膜电阻; Value: 0Ω; Tolerance: -; Temperature Coefficient: -; Operating Temperature Range: -55℃~+155℃
R13-R15 = SCR0603J10K: as R100 on sheet 3_语音模块.schdoc; Name: 10kΩ; Symbol: SCR0603J10K; Device: SCR0603J10K; LCSC Part Name: 10kΩ ±5%; Supplier Part: C3017715; Manufacturer Part: SCR0603J10K; Supplier Footprint: 0603; JLCPCB Part Class: 扩展库; Datasheet: https://atta.szlcsc.com/upload/public/pdf/source/20220513/247AF9639BA21CF93567DC289CCC6A22.pdf; Supplier: LCSC; Convert to PCB: yes; Value: 10kΩ
R16 = CRCW06031M00JNEAC: 电阻类型:厚膜电阻;阻值:1MΩ;精度:±5%;功率:100mW;; Manufacturer: VISHAY(威世); Add into BOM: yes; Tolerance: ±5%; Power(Watts): 100mW; Temperature Coefficient: ±200ppm/℃; Overload Voltage (Max): 75V; Name: 1MΩ; Symbol: CRCW06031M00JNEAC; Device: CRCW06031M00JNEAC; LCSC Part Name: 1MΩ ±5% 100mW; Supplier Part: C1511824; Manufacturer Part: CRCW06031M00JNEAC; Supplier Footprint: 0603; JLCPCB Part Class: 扩展库; Datasheet: https://atta.szlcsc.com/upload/public/pdf/source/20210501/3A8C68602BA6317D7357138250FC3EA2.pdf; Supplier: LCSC; Convert to PCB: yes; Type: 厚膜电阻; Value: 1MΩ; Operating Temperature Range: -55℃~+155℃
RES = K2-6639SP-C4SC-04: 触点电流:50mA;额定电压(DC):12V;绝缘电阻:100MΩ;安装方式:立贴;作用力:250gf@±30gf;机械寿命:1000000;工作温度:-25℃~+85℃;开关长度:6mm;开关宽度:6mm;开关高度:5mm;; Manufacturer: 韩国韩荣; Symbol: K2-6639SP-C4SC-04_C879344; Add into BOM: yes; Contact Current: 50mA; Voltage Rating (DC): 12V; Insulation Resistance: 100MΩ; Mounting Sytle: 立贴; Switch Length: 6mm; Switch Height: 5mm; Name: K2-6639SP-C4SC-04; Device: K2-6639SP-C4SC-04; LCSC Part Name: K2-6639SP-C4SC-04; Supplier Part: C879344; Manufacturer Part: K2-6639SP-C4SC-04; Supplier Footprint: SMD; JLCPCB Part Class: 扩展库; Datasheet: https://atta.szlcsc.com/upload/public/pdf/source/20200721/C707344_FB3B602593668C8FE1542A3F64DDEE0A.pdf; Supplier: LCSC; Convert to PCB: yes; Operating Force: 250gf@±30gf; Mechanical Life: 1000000; Operating Temperature: -25℃~+85℃; Switch Width: 6mm
U27-U29 U44 = C1608JB1C106M080AB: 容值:10uF;精度:±20%;额定电压:16V;材质(温度系数):JB;; Manufacturer: TDK; Add into BOM: yes; Tolerance: ±20%; Voltage Rated: 16V; Temperature Coefficient: JB; Name: 10uF; Symbol: C1608JB1C106M080AB; Device: C1608JB1C106M080AB; LCSC Part Name: 10uF ±20% 16V; Supplier Part: C3866185; Manufacturer Part: C1608JB1C106M080AB; Supplier Footprint: 0603; Supplier: LCSC; Convert to PCB: yes; Value: 10uF
U35 = ZX-XH2.54-4PZZ: 参考系列:XH;间距:2.54mm;插针结构:1x4P;排数:1;每排PIN数:4;行距:-;公母:公型插针;安装方式:直插;额定电流:3A;触头材质:黄铜;触头镀层:锡;工作温度范围:-25℃~+85℃;焊接温度(最大值):260℃;; Manufacturer: Megastar(兆星); Add into BOM: yes; Reference Series: XH; Pitch: 2.54mm; Pins Structure: 1x4P; Number of PINs Per Row: 4; Gender: 公型插针; Current Rating (Max): 3A; Welding Temperature (Max): 260℃; Name: ZX-XH2.54-4PZZ; Symbol: ZX-XH2.54-4PZZ; Device: ZX-XH2.54-4PZZ; LCSC Part Name: 系列:XH 间距:2.54mm 1x4P 直插; Supplier Part: C7429634; Manufacturer Part: ZX-XH2.54-4PZZ; Supplier Footprint: 插件,P=2.54mm; JLCPCB Part Class: 扩展库; Datasheet: https://atta.szlcsc.com/upload/public/pdf/source/20230619/B529A2163E0159A644AB3383D208FB03.pdf; Supplier: LCSC; Convert to PCB: yes; Number of Rows: 1; Row Spacing: -; Mounting Style: 直插; Contact Material: 黄铜; Contact Plating: 锡; Operating Temperature Range: -25℃~+85℃
U36-U39 = C1608CH2A180J080AA: 容值:18pF;精度:±5%;额定电压:100V;材质(温度系数):CH;; Manufacturer: TDK; Add into BOM: yes; Tolerance: ±5%; Voltage Rated: 100V; Temperature Coefficient: CH; Name: 18pF; Symbol: C1608CH2A180J080AA; Device: C1608CH2A180J080AA; LCSC Part Name: 18pF ±5% 100V; Supplier Part: C3847790; Manufacturer Part: C1608CH2A180J080AA; Supplier Footprint: -; JLCPCB Part Class: 扩展库; Supplier: LCSC; Convert to PCB: yes; Value: 18pF
U40 = STM32F407ZET6: CPU内核:ARM Cortex-M4;CPU最大主频:168MHz;工作电压范围:1.8V~3.6V;程序存储容量:512KB;程序存储器类型:FLASH;RAM总容量:192KB;GPIO端口数量:114;; Manufacturer: ST(意法半导体); Add into BOM: yes; CPU Maximum Speed: 168MHz; Program Storage Size: 512KB; Program Memory Type: FLASH; RAM Size: 192KB; GPIO Ports Number: 114; ADC (Bit): 12bit; Universal Serial Bus: 有; tags: STM32; Name: STM32F407ZET6; Symbol: STM32F407ZET6; Device: STM32F407ZET6; LCSC Part Name: STM32F407ZET6; Supplier Part: C36869; Manufacturer Part: STM32F407ZET6; Supplier Footprint: LQFP-144(20x20); JLCPCB Part Class: 扩展库; Datasheet: https://atta.szlcsc.com/upload/public/pdf/source/20160816/1471342957598.pdf; Supplier: LCSC; Convert to PCB: yes; CPU Core: ARM Cortex-M4; Operating Voltage Range: 1.8V~3.6V; EEPROM: -; DAC (Bit): 12bit; PWM (Bit): -; Internal Comparator: -; communication protocol: -; Watchdog: 有; Real-Time Clock: -; Infrared Data Association: 有; Low-Voltage Detect: 有; CCP Capture/Compare: -; LCD Module: 有; Secure Digital Input and Output: -; Direct Memory Access: 有; Internal Oscillator: 有; Operating Temperature Range: -40℃~+85℃; image: http://image.lceda.cn/szlcsc/C36869.jpg
X2 = TAXM8M2QLFCDT1T: 频率:8MHz;频率公差:±30ppm;负载电容:20pF;; Manufacturer: TAE(雅晶鑫); Symbol: SMD-5032_2P 8M 20pf 30ppm; Add into BOM: yes; Crystal Type: 贴片无源晶振; Frequency Tolerance: ±30ppm; Frequency Stability: ±20ppm; Load Capacitance: 20pF; Equivalent Series Resistance (ESR): 80Ω; Name: 8MHz; Device: TAXM8M2QLFCDT1T; LCSC Part Name: 8MHz ±30ppm 20pF; Supplier Part: C122522; Manufacturer Part: TAXM8M2QLFCDT1T; Supplier Footprint: SMD5032-2P; JLCPCB Part Class: 扩展库; Datasheet: https://atta.szlcsc.com/upload/public/pdf/source/20220113/59EE8A0E7B9F67FF1BF3C454890DE4E5.pdf; Supplier: LCSC; Convert to PCB: yes; Value: 8MHz; Operating Temperature: -40℃~+85℃
X3 = TFX-04-32.768K: 频率:-;负载电容:-;; Manufacturer: RIVER(大河); Symbol: TFX-04-32.768K_C515348; Add into BOM: yes; Name: -; Device: TFX-04-32.768K; LCSC Part Name: 时钟晶体 32.768kHz 4PF 20PPM; Supplier Part: C515348; Manufacturer Part: TFX-04-32.768K; Supplier Footprint: SMD1610-2P; JLCPCB Part Class: 扩展库; Datasheet: https://atta.szlcsc.com/upload/public/pdf/source/20200917/C515346_EDFB4A3F7406CD145B2E2A90CB656616.pdf; Supplier: LCSC; Convert to PCB: yes; Crystal Type: -; Value: -; Load Capacitance: -; Operating Temperature: -

## Nets that join several sheets
3V3: 4_POW.schdoc (8 pins), 3_语音模块.schdoc (15 pins), 2_MCU.schdoc (26 pins)
+5V: 4_POW.schdoc (16 pins), 3_语音模块.schdoc (C102.2 P11.28 P100.12)
GND: 4_POW.schdoc (29 pins), 3_语音模块.schdoc (13 pins), 2_MCU.schdoc (30 pins)
DCMI_D0: 3_语音模块.schdoc (P100.6), 2_MCU.schdoc (U40.96)
F_CS: 3_语音模块.schdoc (U12#2.1), 2_MCU.schdoc (U40.75)
FSMC_A0: 3_语音模块.schdoc (U10.5), 2_MCU.schdoc (U40.10)
FSMC_A1: 3_语音模块.schdoc (U10.4), 2_MCU.schdoc (U40.11)
FSMC_A2: 3_语音模块.schdoc (U10.3), 2_MCU.schdoc (U40.12)
FSMC_A3: 3_语音模块.schdoc (U10.2), 2_MCU.schdoc (U40.13)
FSMC_A4: 3_语音模块.schdoc (U10.1), 2_MCU.schdoc (U40.14)
FSMC_A5: 3_语音模块.schdoc (U10.24), 2_MCU.schdoc (U40.15)
FSMC_A6: 3_语音模块.schdoc (P11.2 U10.23), 2_MCU.schdoc (U40.50)
FSMC_A7: 3_语音模块.schdoc (U10.22), 2_MCU.schdoc (U40.53)
FSMC_A8: 3_语音模块.schdoc (U10.21), 2_MCU.schdoc (U40.54)
FSMC_A9: 3_语音模块.schdoc (U10.20), 2_MCU.schdoc (U40.55)
FSMC_A10: 3_语音模块.schdoc (U10.19), 2_MCU.schdoc (U40.56)
FSMC_A11: 3_语音模块.schdoc (U10.18), 2_MCU.schdoc (U40.57)
FSMC_A12: 3_语音模块.schdoc (U10.28), 2_MCU.schdoc (U40.87)
FSMC_A13: 3_语音模块.schdoc (U10.27), 2_MCU.schdoc (U40.88)
FSMC_A14: 3_语音模块.schdoc (U10.26), 2_MCU.schdoc (U40.89)
FSMC_A15: 3_语音模块.schdoc (U10.25), 2_MCU.schdoc (U40.90)
FSMC_A16: 3_语音模块.schdoc (U10.42), 2_MCU.schdoc (U40.80)
FSMC_A17: 3_语音模块.schdoc (U10.43), 2_MCU.schdoc (U40.81)
FSMC_A18: 3_语音模块.schdoc (U10.44), 2_MCU.schdoc (U40.82)
FSMC_D0: 3_语音模块.schdoc (P11.6 U10.7), 2_MCU.schdoc (U40.85)
FSMC_D1: 3_语音模块.schdoc (P11.7 U10.8), 2_MCU.schdoc (U40.86)
FSMC_D2: 3_语音模块.schdoc (P11.8 U10.9), 2_MCU.schdoc (U40.114)
FSMC_D3: 3_语音模块.schdoc (P11.9 U10.10), 2_MCU.schdoc (U40.115)
FSMC_D4: 3_语音模块.schdoc (P11.10 U10.13), 2_MCU.schdoc (U40.58)
FSMC_D5: 3_语音模块.schdoc (P11.11 U10.14), 2_MCU.schdoc (U40.59)
FSMC_D6: 3_语音模块.schdoc (P11.12 U10.15), 2_MCU.schdoc (U40.60)
FSMC_D7: 3_语音模块.schdoc (P11.13 U10.16), 2_MCU.schdoc (U40.63)
FSMC_D8: 3_语音模块.schdoc (P11.14 U10.29), 2_MCU.schdoc (U40.64)
FSMC_D9: 3_语音模块.schdoc (P11.15 U10.30), 2_MCU.schdoc (U40.65)
FSMC_D10: 3_语音模块.schdoc (P11.16 U10.31), 2_MCU.schdoc (U40.66)
FSMC_D11: 3_语音模块.schdoc (P11.17 U10.32), 2_MCU.schdoc (U40.67)
FSMC_D12: 3_语音模块.schdoc (P11.18 U10.35), 2_MCU.schdoc (U40.68)
FSMC_D13: 3_语音模块.schdoc (P11.19 U10.36), 2_MCU.schdoc (U40.77)
FSMC_D14: 3_语音模块.schdoc (P11.20 U10.37), 2_MCU.schdoc (U40.78)
FSMC_D15: 3_语音模块.schdoc (P11.21 U10.38), 2_MCU.schdoc (U40.79)
FSMC_NBL0: 3_语音模块.schdoc (U10.39), 2_MCU.schdoc (U40.141)
FSMC_NBL1: 3_语音模块.schdoc (U10.40), 2_MCU.schdoc (U40.142)
FSMC_NE3: 3_语音模块.schdoc (R100.2 U10.6), 2_MCU.schdoc (U40.125)
FSMC_NE4: 3_语音模块.schdoc (P11.1), 2_MCU.schdoc (U40.127)
FSMC_NOE: 3_语音模块.schdoc (P11.4 U10.41), 2_MCU.schdoc (U40.118)
FSMC_NWE: 3_语音模块.schdoc (P11.3 U10.17), 2_MCU.schdoc (U40.119)
IIC_SCL: 3_语音模块.schdoc (P100.5 R110.1), 2_MCU.schdoc (U40.139)
IIC_SDA: 3_语音模块.schdoc (P100.8 R111.1), 2_MCU.schdoc (U40.140)
LCD_BL: 3_语音模块.schdoc (P11.23), 2_MCU.schdoc (U40.76)
RESET: 3_语音模块.schdoc (P11.5), 2_MCU.schdoc (5 pins)
S_DOUT: 3_语音模块.schdoc (P100.4), 2_MCU.schdoc (U40.28)
S_LRCK: 3_语音模块.schdoc (P100.2), 2_MCU.schdoc (U40.73)
S_SCLK: 3_语音模块.schdoc (P100.1), 2_MCU.schdoc (U40.74)
S_SDIN: 3_语音模块.schdoc (P100.3), 2_MCU.schdoc (U40.29)
SPI1_MISO: 3_语音模块.schdoc (U12#2.2), 2_MCU.schdoc (U40.134)
SPI1_MOSI: 3_语音模块.schdoc (U12#2.5), 2_MCU.schdoc (U40.135)
SPI1_SCK: 3_语音模块.schdoc (U12#2.6), 2_MCU.schdoc (U40.133)
T_CS: 3_语音模块.schdoc (P11.33), 2_MCU.schdoc (U40.7)
T_MISO: 3_语音模块.schdoc (P11.29), 2_MCU.schdoc (R14.1 U40.48)
T_MOSI: 3_语音模块.schdoc (P11.30), 2_MCU.schdoc (U40.49)
T_PEN: 3_语音模块.schdoc (P11.31), 2_MCU.schdoc (U40.47)
T_SCK: 3_语音模块.schdoc (P11.34), 2_MCU.schdoc (U40.46)